# Altium schematic sheet USB_connect.SchDoc
size A4
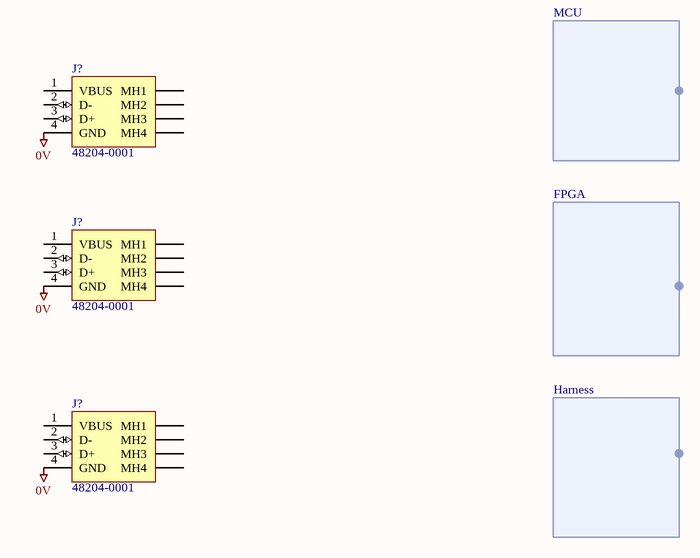
[diagram p0: USB_connect.SchDoc]

## Parts
(Parts that share a designator on the sheet are numbered #1, #2 ... from top to bottom, then left to right.)
J?#1  48204-0001  [MOLX-48204-0001_V]
J?#2  48204-0001  [MOLX-48204-0001_V]
J?#3  48204-0001  [MOLX-48204-0001_V]

## Harnesses
MCU: 
FPGA: 
Harness: 

## Nets
0V: J?#1.4(GND) J?#2.4(GND) J?#3.4(GND)

Not connected (* = marked no-connect by the designer): J?#1 1(VBUS) 2(D-) 3(D+) MH1 MH2 MH3 MH4; J?#2 1(VBUS) 2(D-) 3(D+) MH1 MH2 MH3 MH4; J?#3 1(VBUS) 2(D-) 3(D+) MH1 MH2 MH3 MH4

## Library data of the parts
J?#1-J?#3 = CMP-0411-00001-2: USB Shielded I/O Receptacle, Type A; Required PB Thickness: 1.6 mm; ComponentLink2URL: http://www.molex.com/pdm_docs/sd/482040001_sd.pdf; PartNumber: 48204-0001; Contact Finish: Bronze; PackageDescription: USB Type-A Up-Right Reverse Connector; ComponentLink1URL: http://www.molex.com/; ComponentLink2Description: Datasheet; DatasheetVersion: Rev D, 04/2006; ComponentLink1Description: Manufacturer URL; Mounting Technology: Through Hole